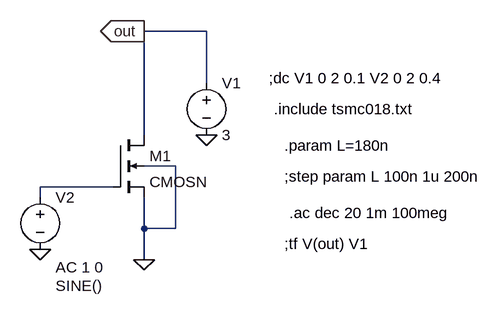
[diagram p0: schematic machNMOS.asc]
machNMOS.asc, the LTspice schematic file:
Version 4
SHEET 1 1512 680
WIRE 208 -240 112 -240
WIRE 208 -160 208 -240
WIRE 112 -80 112 -240
WIRE 160 -32 112 -32
WIRE 64 0 -48 0
WIRE -48 16 -48 0
WIRE 112 64 112 16
WIRE 160 64 160 -32
WIRE 160 64 112 64
WIRE 112 112 112 64
FLAG -48 96 0
FLAG 112 112 0
FLAG 208 -80 0
FLAG 112 -240 out
IOPIN 112 -240 Out
SYMBOL voltage 208 -176 R0
WINDOW 123 0 0 Left 0
WINDOW 39 0 0 Left 0
SYMATTR InstName V1
SYMATTR Value 3
SYMBOL voltage -48 0 R0
WINDOW 123 24 124 Left 2
WINDOW 39 0 0 Left 0
WINDOW 3 24 152 Left 2
SYMATTR Value2 AC 1 0
SYMATTR Value SINE()
SYMATTR InstName V2
SYMBOL nmos4 64 -80 R0
SYMATTR InstName M1
SYMATTR Value CMOSN
SYMATTR Value2 l=L w=0.3L
TEXT 304 -168 Left 2 !;dc V1 0 2 0.1 V2 0 2 0.4
TEXT 312 -120 Left 2 !.include tsmc018.txt
TEXT 328 -64 Left 2 !.param L=180n
TEXT 328 -16 Left 2 !;step param L 100n 1u 200n
TEXT 336 40 Left 2 !.ac dec 20 1m 100meg
TEXT 328 88 Left 2 !;tf V(out) V1

The netlist it stands for:
* machNMOS.asc
V1 out 0 3
V2 N001 0 SINE() AC 1 0
M1 out N001 0 0 CMOSN l=L w=0.3L
.model NMOS NMOS
.model PMOS PMOS
.lib standard.mos
;dc V1 0 2 0.1 V2 0 2 0.4
.include tsmc018.txt
.param L=180n
;step param L 100n 1u 200n
.ac dec 20 1m 100meg
;tf V(out) V1
.backanno
.end